# Altium project bolid.PrjPcb (part 3 of 6)

## Sheet bolid-power-dcdc-ldo.SchDoc
size A3
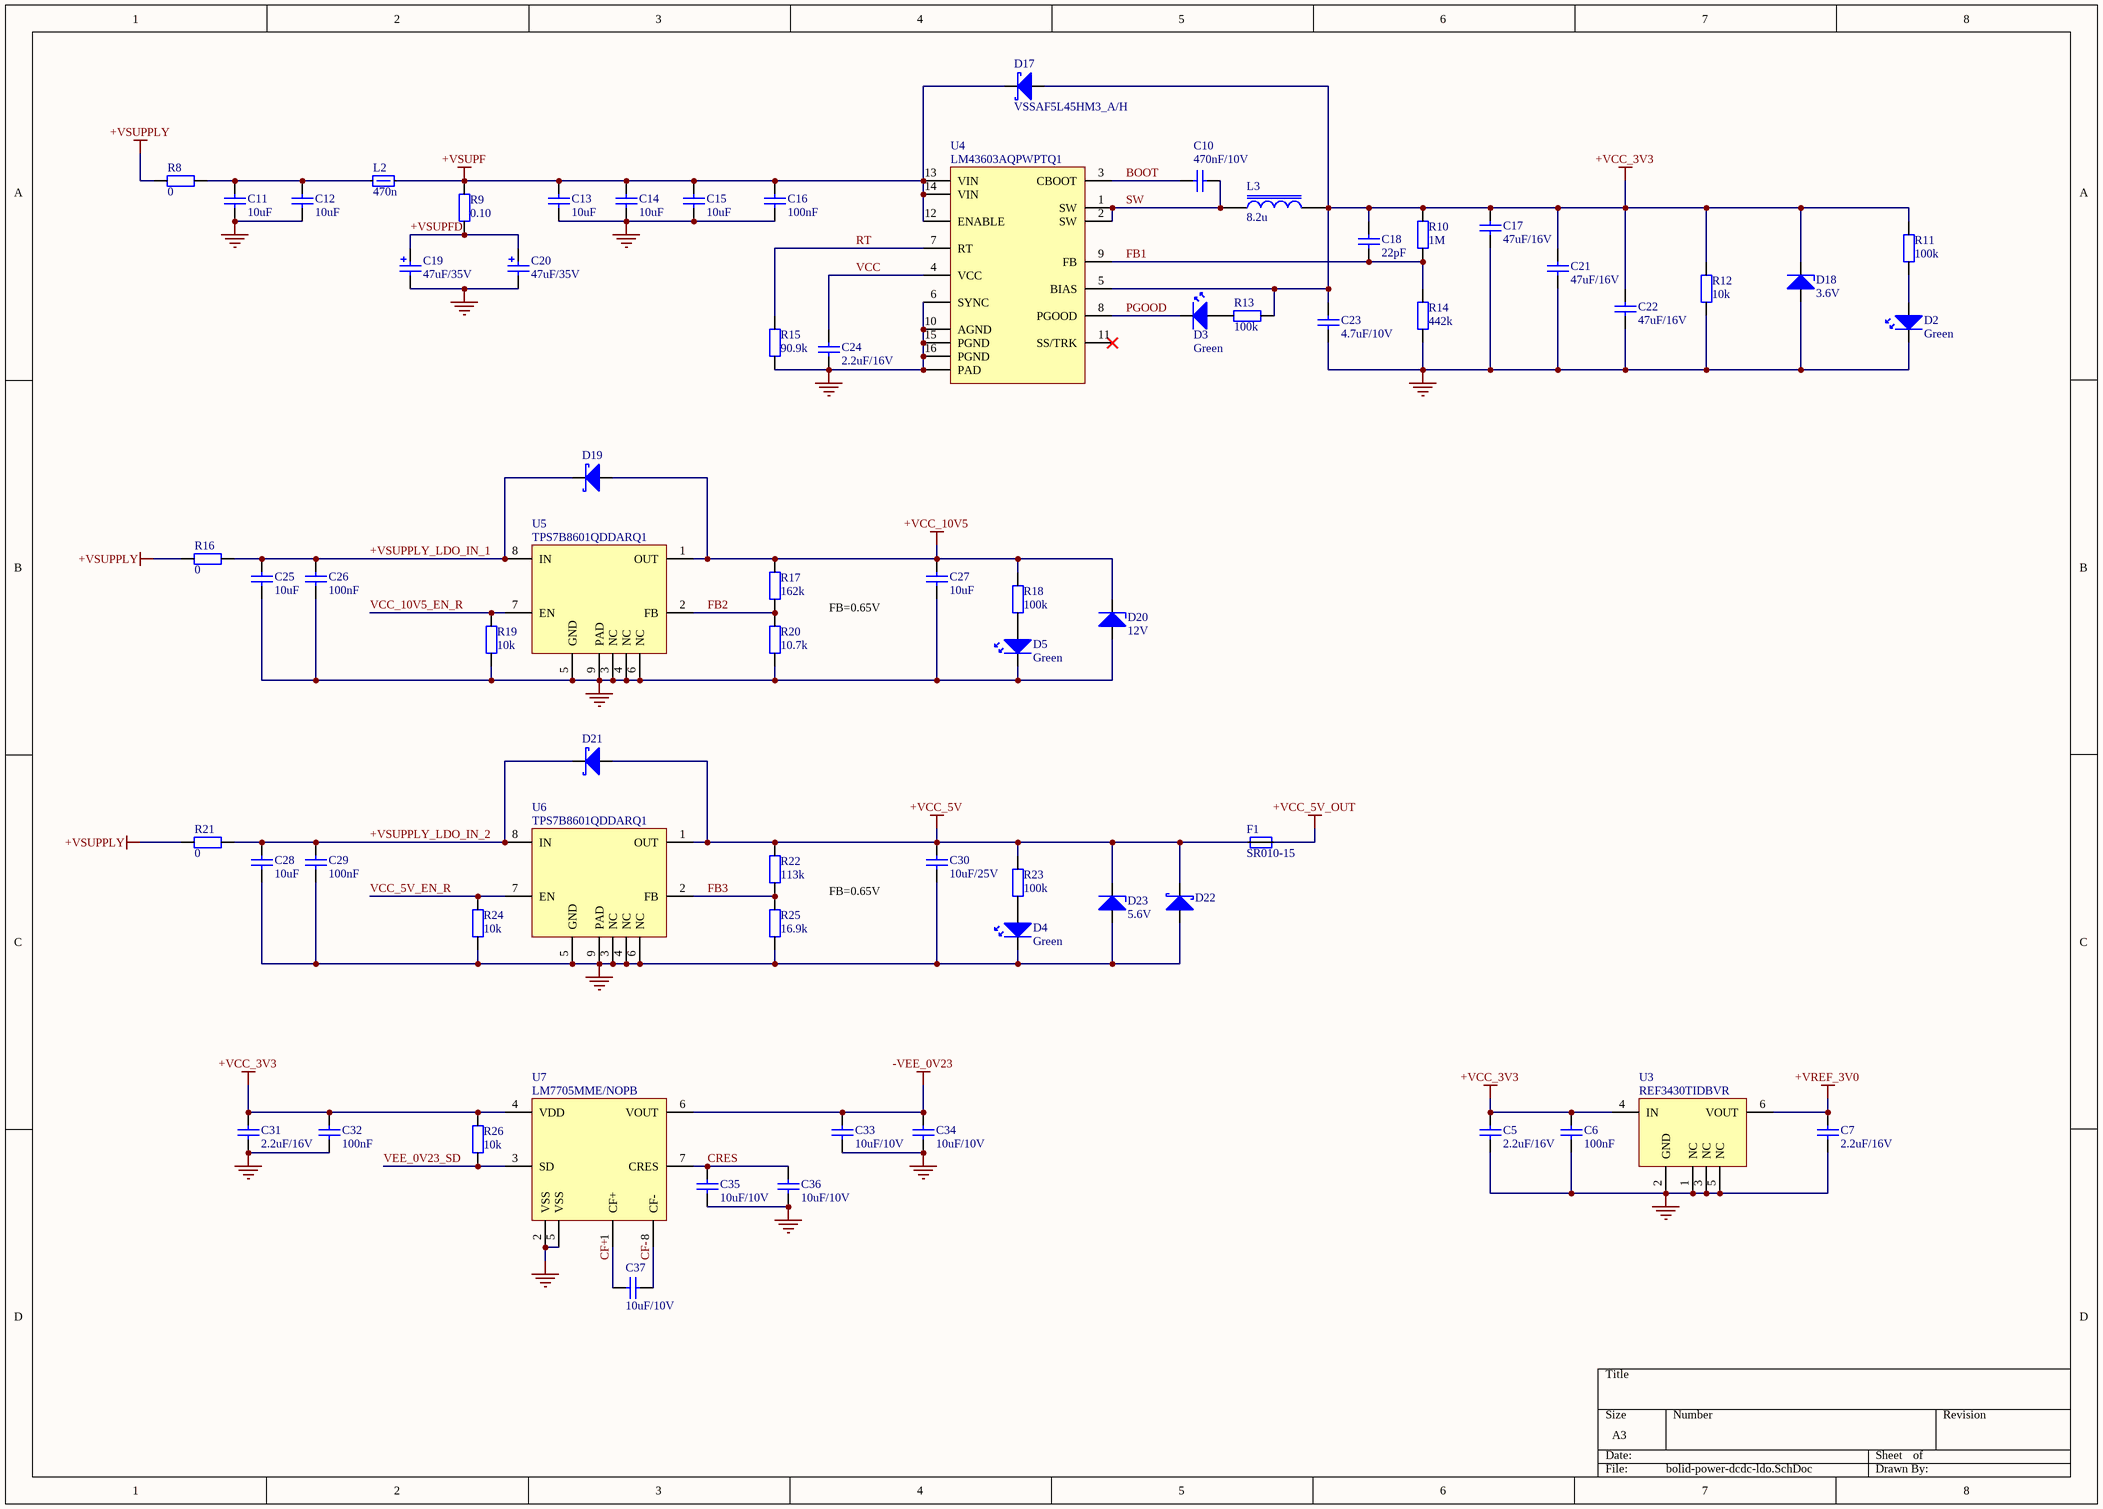
[diagram p5: bolid-power-dcdc-ldo.SchDoc]

### Parts
C5  Value Displayed: 2.2uF/16V  [C0603-CAPC162X80X95L35N]  (hidden comment: EMK107BB7225MA-T)
C6  Value Displayed: 100nF  [C0402-CAPC100X50X55L22 - Tayio Yuden TDK]  (hidden comment: GRM155R71H104KE14D)
C7  Value Displayed: 2.2uF/16V  [C0603-CAPC162X80X95L35N]  (hidden comment: EMK107BB7225MA-T)
C10  Value Displayed: 470nF/10V  [C0402-CAPC100X50X55L22 - Tayio Yuden TDK]  (hidden comment: GRM155R71A474KE01D)
C11  Value Displayed: 10uF  [C1210-CAPC320X250X280L55N - Kemet]  (hidden comment: C1210C106K5RACTU)
C12  Value Displayed: 10uF  [C1210-CAPC320X250X280L55N - Kemet]  (hidden comment: C1210C106K5RACTU)
C13  Value Displayed: 10uF  [C1210-CAPC320X250X280L55N - Kemet]  (hidden comment: C1210C106K5RACTU)
C14  Value Displayed: 10uF  [C1210-CAPC320X250X280L55N - Kemet]  (hidden comment: C1210C106K5RACTU)
C15  Value Displayed: 10uF  [C1210-CAPC320X250X280L55N - Kemet]  (hidden comment: C1210C106K5RACTU)
C16  Value Displayed: 100nF  [C0402-CAPC100X50X55L22 - Tayio Yuden TDK]  (hidden comment: GRM155R71H104KE14D)
C17  Value Displayed: 47uF/16V  [C1210-CAPC320X250X280L55N - Kemet]  (hidden comment: EMK325BJ476MM-P)
C18  Value Displayed: 22pF  [C0402-CAPC100X50X55L22 - Tayio Yuden TDK]  (hidden comment: GCM1555C1H220JA16D)
C19  Value Displayed: 47uF/35V  [C7374-43-CAPPM730X430X430L130X240N - Kemet Case X]  (hidden comment: T495X476K035ATE300)
C20  Value Displayed: 47uF/35V  [C7374-43-CAPPM730X430X430L130X240N - Kemet Case X]  (hidden comment: T495X476K035ATE300)
C21  Value Displayed: 47uF/16V  [C1210-CAPC320X250X280L55N - Kemet]  (hidden comment: EMK325BJ476MM-P)
C22  Value Displayed: 47uF/16V  [C1210-CAPC320X250X280L55N - Kemet]  (hidden comment: EMK325BJ476MM-P)
C23  Value Displayed: 4.7uF/10V  [C0402-CAPC100X50X55L22 - Tayio Yuden TDK]  (hidden comment: C1005X5R1A475M050BC)
C24  Value Displayed: 2.2uF/16V  [C0603-CAPC162X80X95L35N]  (hidden comment: EMK107BB7225MA-T)
C25  Value Displayed: 10uF  [C1210-CAPC320X250X280L55N - Kemet]  (hidden comment: C1210C106K5RACTU)
C26  Value Displayed: 100nF  [C0402-CAPC100X50X55L22 - Tayio Yuden TDK]  (hidden comment: GRM155R71H104KE14D)
C27  Value Displayed: 10uF  [C1210-CAPC320X250X280L55N - Kemet]  (hidden comment: C1210C106K5RACTU)
C28  Value Displayed: 10uF  [C1210-CAPC320X250X280L55N - Kemet]  (hidden comment: C1210C106K5RACTU)
C29  Value Displayed: 100nF  [C0402-CAPC100X50X55L22 - Tayio Yuden TDK]  (hidden comment: GRM155R71H104KE14D)
C30  Value Displayed: 10uF/25V  [C1206-CAPC320X160X190L65N - Murata]  (hidden comment: TMK316AB7106KL-T)
C31  Value Displayed: 2.2uF/16V  [C0603-CAPC162X80X95L35N]  (hidden comment: EMK107BB7225MA-T)
C32  Value Displayed: 100nF  [C0402-CAPC100X50X55L22 - Tayio Yuden TDK]  (hidden comment: GRM155R71H104KE14D)
C33  Value Displayed: 10uF/10V  [C0805-CAPC200X125X135L50N - Taiyo YudenN]  (hidden comment: GRM21BR71A106KA73K)
C34  Value Displayed: 10uF/10V  [C0805-CAPC200X125X135L50N - Taiyo YudenN]  (hidden comment: GRM21BR71A106KA73K)
C35  Value Displayed: 10uF/10V  [C0805-CAPC200X125X135L50N - Taiyo YudenN]  (hidden comment: GRM21BR71A106KA73K)
C36  Value Displayed: 10uF/10V  [C0805-CAPC200X125X135L50N - Taiyo YudenN]  (hidden comment: GRM21BR71A106KA73K)
C37  Value Displayed: 10uF/10V  [C0805-CAPC200X125X135L50N - Taiyo YudenN]  (hidden comment: GRM21BR71A106KA73K)
D2  Illumination Color: Green  [D0603 DIONC166X84X36L42N Littelfuse]  (hidden comment: 150060GS75000)
D3  Illumination Color: Green  [D0603 DIONC166X84X36L42N Littelfuse]  (hidden comment: 150060GS75000)
D4  Illumination Color: Green  [D0603 DIONC166X84X36L42N Littelfuse]  (hidden comment: 150060GS75000)
D5  Illumination Color: Green  [D0603 DIONC166X84X36L42N Littelfuse]  (hidden comment: 150060GS75000)
D17  VSSAF5L45HM3_A/H  [DO-221AC SlimSMA SODFL520X260X100L97X135N - Vishay]
D18  Zener Voltage: 3.6V  [SOT23 (TO-236AB) 04-11-04 SOT95P230X110-3N - Nexperia]  (hidden comment: BZX84-B3V6,215)
D19  MBR0530T3G  [SOD-123-2L SOD375X160X128L32X60N - Fairchild]  (value not drawn)
D20  Zener Voltage: 12V  [SOT23 (TO-236AB) 04-11-04 SOT95P230X110-3N - Nexperia]  (hidden comment: BZX84-C12,215)
D21  MBR0530T3G  [SOD-123-2L SOD375X160X128L32X60N - Fairchild]  (value not drawn)
D22  MBR0530T3G  [SOD-123-2L SOD375X160X128L32X60N - Fairchild]  (value not drawn)
D23  Zener Voltage: 5.6V  [SOT23 (TO-236AB) 04-11-04 SOT95P230X110-3N - Nexperia]  (hidden comment: BZX84-B5V6,215)
F1  SR010-15  [RESC2214X10N - SR010-15]
L2  value 470n  [MURATA DFE252012F 1008 INDC250X200X120L60N]  (hidden comment: DFE252012F-R47M=P2)
L3  value 8.2u  [Coilcraft XAL50xx]  (hidden comment: XAL5050-822MEB)
R8  value 0  [R0603-RESC160X80X55L30N]  (hidden comment: RC0603FR-070RL)
R9  value 0.10  [R0603-RESC160X80X55L30N]  (hidden comment: ERJ-3RSFR10V)
R10  value 1M  [R0402-RESC100X50X40L22N]  (hidden comment: AC0402FR-071ML)
R11  value 100k  [R0402-RESC100X50X40L22N]  (hidden comment: RC0402FR-07100KL)
R12  value 10k  [R0402-RESC100X50X40L22N]  (hidden comment: RC0402FR-0710KL)
R13  value 100k  [R0402-RESC100X50X40L22N]  (hidden comment: RC0402FR-07100KL)
R14  value 442k  [R0402-RESC100X50X40L22N]  (hidden comment: ERJ-2RKF4423X)
R15  value 90.9k  [R0402-RESC100X50X40L22N]  (hidden comment: RC0402FR-0790K9L)
R16  value 0  [R0603-RESC160X80X55L30N]  (hidden comment: RC0603FR-070RL)
R17  value 162k  [R0402-RESC100X50X40L22N]  (hidden comment: AC0402FR-07162KL)
R18  value 100k  [R0402-RESC100X50X40L22N]  (hidden comment: RC0402FR-07100KL)
R19  value 10k  [R0402-RESC100X50X40L22N]  (hidden comment: RC0402FR-0710KL)
R20  value 10.7k  [R0402-RESC100X50X40L22N]  (hidden comment: AC0402FR-0710K7L)
R21  value 0  [R0603-RESC160X80X55L30N]  (hidden comment: RC0603FR-070RL)
R22  value 113k  [R0402-RESC100X50X40L22N]  (hidden comment: RC0402FR-07113KL)
R23  value 100k  [R0402-RESC100X50X40L22N]  (hidden comment: RC0402FR-07100KL)
R24  value 10k  [R0402-RESC100X50X40L22N]  (hidden comment: RC0402FR-0710KL)
R25  value 16.9k  [R0402-RESC100X50X40L22N]  (hidden comment: RC0402FR-0716K9L)
R26  value 10k  [R0402-RESC100X50X40L22N]  (hidden comment: RC0402FR-0710KL)
U3  REF3430TIDBVR  [TI SOT23 DBV0006A SOT23-6P95_280X145L45X37N]
U4  LM43603AQPWPTQ1  [TI TSSOP16 PWP0016G SOP17P65_500X640X120L62X24T300X210N - NO PASTE REDUCTION]
U5  TPS7B8601QDDARQ1  [TI SOIC8 DDA0008E-C01 SOIC127P600X170_HS-9N]
U6  TPS7B8601QDDARQ1  [TI SOIC8 DDA0008E-C01 SOIC127P600X170_HS-9N]
U7  LM7705MME/NOPB  [TI VSSOP8 DGK0008A TSOP65P490X110-8N]

### Nets
+VCC_3V3: C5.2 C6.2 C17.2 C18.2 C21.2 C22.2 C23.2 C31.2 C32.2 D17.2(A) D18.3(K) L3.2 R10.2 R11.2 R12.2 R13.2 R26.2 U3.4(IN) U4.5(BIAS) U7.4(VDD)
+VCC_5V: C30.2 D21.2(A) D22.1(K) D23.3(K) F1.1 R22.2 R23.2 U6.1(OUT)
+VCC_5V_OUT: F1.2
+VCC_10V5: C27.2 D19.2(A) D20.3(K) R17.2 R18.2 U5.1(OUT)
+VREF_3V0: C7.2 U3.6(VOUT)
+VSUPF: C13.2 C14.2 C15.2 C16.2 D17.1(K) L2.2 R9.2 U4.12(ENABLE) U4.13(VIN) U4.14(VIN)
+VSUPPLY: R8.1 R16.1 R21.1
-VEE_0V23: C33.2 C34.2 U7.6(VOUT)
GND: C5.1 C6.1 C7.1 C11.1 C12.1 C13.1 C14.1 C15.1 C16.1 C17.1 C19.1 C20.1 C21.1 C22.1 C23.1 C24.1 C25.1 C26.1 C27.1 C28.1 C29.1 C30.1 C31.1 C32.1 C33.1 C34.1 C35.1 C36.1 D2.1(K) D4.1(K) D5.1(K) D18.1(A) D20.1(A) D22.2(A) D23.1(A) R12.1 R14.1 R15.1 R19.1 R20.1 R24.1 R25.1 U3.1(NC) U3.2(GND) U3.3(NC) U3.5(NC) U4.6(SYNC) U4.10(AGND) U4.15(PGND) U4.16(PGND) U4.17(PAD) U5.3(NC) U5.4(NC) U5.5(GND) U5.6(NC) U5.9(PAD) U6.3(NC) U6.4(NC) U6.5(GND) U6.6(NC) U6.9(PAD) U7.2(VSS) U7.5(VSS)
+VSUPFD: C19.2 C20.2 R9.1
+VSUPPLY_LDO_IN_1: C25.2 C26.2 D19.1(K) R16.2 U5.8(IN)
+VSUPPLY_LDO_IN_2: C28.2 C29.2 D21.1(K) R21.2 U6.8(IN)
BOOT: C10.1 U4.3(CBOOT)
CF+: C37.2 U7.1(CF+)
CF-: C37.1 U7.8(CF-)
CRES: C35.2 C36.2 U7.7(CRES)
FB1: C18.1 R10.1 R14.2 U4.9(FB)
FB2: R17.1 R20.2 U5.2(FB)
FB3: R22.1 R25.2 U6.2(FB)
PGOOD: D3.1(K) U4.8(PGOOD)
RT: R15.2 U4.7(RT)
SW: C10.2 L3.1 U4.1(SW) U4.2(SW)
VCC: C24.2 U4.4(VCC)
VCC_5V_EN_R: R24.2 U6.7(EN)
VCC_10V5_EN_R: R19.2 U5.7(EN)
VEE_0V23_SD: R26.1 U7.3(SD)
NetC11_2: C11.2 C12.2 L2.1 R8.2
NetD2_2: D2.2(A) R11.1
NetD3_2: D3.2(A) R13.1
NetD4_2: D4.2(A) R23.1
NetD5_2: D5.2(A) R18.1

Not connected (* = marked no-connect by the designer): U4 11(SS/TRK)*

### Notes on the sheet
- (near C27) FB=0.65V
- (near C30) FB=0.65V

### Library data of the parts
C5 C7 C24 C31 = EMK107BB7225MA-T: MLCC 0603 (1608) 2.2uF 20% 16V X7R; Manufacturer: Taiyo Yuden; Type: AECStandardQ200; Voltage Rating DC: 16 VDC; Capacitance - nF: 2200 nF; Value: 2.2u; Supplier 1: Mouser; Manufacturer Part Number: EMK107BB7225MA-T; RoHS: RoHS Compliant; Category: Multilayer Ceramic Capacitors MLCC - SMD/SMT; Stock 1: 5687; Pricing 1: 1=0.324, 10=0.228, 100=0.129, 500=0.090, 1000=0.078, 4000=0.060, 8000=0.057, 12000=0.055, 24000=0.048 (EUR); Capacitance: 2.2 uF; Height: 0.8 mm; Length: 1.6 mm; Package / Case: 0603 (1608 metric); Packaging: Cut Tape; Product: Automotive MLCCs; Series: M; Termination Style: SMD/SMT; Tolerance: 20 %; Width: 0.8 mm; Brand: Taiyo Yuden; Case Code - in: 0603; Case Code - mm: 1608; Dielectric: X7R; Maximum Operating Temperature: + 125 C; Minimum Operating Temperature: - 55 C; Product Type: Ceramic Capacitors; Standard Pack Qty: 4000; Subcategory: Capacitors; Termination: Standard; RoHS - Mouser: Y; Minimum Order Quantity: 1; Reeling: True; ComponentLink1URL: https://www.mouser.com/datasheet/2/396/mlcc02_e-1307760.pdf; ComponentLink1Description: https://www.mouser.com/datasheet/2/396/mlcc02_e-1307760.pdf; Supplier Part Number 1: 963-EMK107BB7225MA-T
C6 C16 C26 C29 C32 = GRM155R71H104KE14D: MLCC 0402 (1005) 100nF 10% 50V X7R; Manufacturer: Murata Electronics; Capacitance: 0.1 uF; Type: Chip Multilayer Ceramic Capacitor for General Purpose; Voltage Rating DC: 50 VDC; Capacitance - pF: 100000 pF; Class: Class 2; Supplier 1: Mouser; Manufacturer Part Number: GRM155R71H104KE14D; RoHS: RoHS Compliant; Category: Multilayer Ceramic Capacitors MLCC - SMD/SMT; Stock 1: 3511637; Pricing 1: 1=0.090, 10=0.038, 100=0.016, 500=0.012, 1000=0.009, 2500=0.008, 5000=0.007, 10000=0.005 (EUR); Height: 0.5 mm; Length: 1 mm; Package / Case: 0402 (1005 metric); Packaging: Cut Tape; Product: General Type MLCCs; Series: GRM; Termination Style: SMD/SMT; Tolerance: 10 %; Width: 0.5 mm; Brand: Murata Electronics; Capacitance - nF: 100 nF; Case Code - in: 0402; Case Code - mm: 1005; Dielectric: X7R; Maximum Operating Temperature: + 125 C; Minimum Operating Temperature: - 55 C; Product Type: Ceramic Capacitors; Standard Pack Qty: 10000; Subcategory: Capacitors; Termination: Standard; RoHS - Mouser: Y; Minimum Order Quantity: 1; Reeling: True; ComponentLink1URL: https://www.mouser.com/datasheet/2/281/murata_03052018_GRM_Series_1-1310166.pdf; ComponentLink1Description: https://www.mouser.com/datasheet/2/281/murata_03052018_GRM_Series_1-1310166.pdf; Value: 100nF; Supplier Part Number 1: 81-GRM155R71H104KE4D
C10 = GRM155R71A474KE01D: MLCC 0402 (1005) 470nF 10% 10V X7R; Manufacturer: Murata Electronics; Capacitance: 0.47 uF; Type: Chip Multilayer Ceramic Capacitor for General Purpose; Voltage Rating DC: 10 VDC; Capacitance - pF: 470000 pF; Class: Class 2; Value: 470n; Supplier 1: Mouser; Manufacturer Part Number: GRM155R71A474KE01D; RoHS: RoHS Compliant; Category: Multilayer Ceramic Capacitors MLCC - SMD/SMT; Stock 1: 1591702; Pricing 1: 1=0.090, 10=0.064, 100=0.028, 500=0.020, 1000=0.015, 2500=0.014, 5000=0.013, 10000=0.010, 20000=0.009 (EUR); Height: 0.5 mm; Length: 1 mm; Package / Case: 0402 (1005 metric); Packaging: Cut Tape; Product: General Type MLCCs; Series: GRM; Termination Style: SMD/SMT; Tolerance: 10 %; Width: 0.5 mm; Brand: Murata Electronics; Capacitance - nF: 470 nF; Case Code - in: 0402; Case Code - mm: 1005; Dielectric: X7R; Maximum Operating Temperature: + 125 C; Minimum Operating Temperature: - 55 C; Product Type: Ceramic Capacitors; Standard Pack Qty: 10000; Subcategory: Capacitors; Termination: Standard; RoHS - Mouser: Y; Minimum Order Quantity: 1; Reeling: True; ComponentLink1URL: https://www.mouser.com/datasheet/2/281/murata_03052018_GRM_Series_1-1310166.pdf; ComponentLink1Description: https://www.mouser.com/datasheet/2/281/murata_03052018_GRM_Series_1-1310166.pdf; Supplier Part Number 1: 81-GRM155R71A474KE1D
C11-C15 C25 C27 C28 = C1210C106K5RACTU: MLCC 1210 (3225) 10uF 10% 50V X7R; Manufacturer: KEMET; Voltage Rating DC: 50 VDC; Class: Class 2; Supplier 1: Mouser; Manufacturer Part Number: C1210C106K5RACTU; RoHS: RoHS Compliant; Category: Multilayer Ceramic Capacitors MLCC - SMD/SMT; Stock 1: 1149; Pricing 1: 1=0.984, 10=0.728, 100=0.498, 500=0.394, 1000=0.296 (USD); Capacitance: 10 uF; Height: 2.5 mm; Length: 3.2 mm; Package / Case: 1210 (3225 metric); Packaging: Cut Tape; Product: General Type MLCCs; Series: SMD Comm X7R; Termination Style: SMD/SMT; Tolerance: 10 %; Voltage Rating AC: -; Width: 2.5 mm; Brand: KEMET; Case Code - in: 1210; Case Code - mm: 3225; Dielectric: X7R; Maximum Operating Temperature: + 125 C; Minimum Operating Temperature: - 55 C; Product Type: Ceramic Capacitors; Standard Pack Qty: 1000; Subcategory: Capacitors; Termination: Standard; RoHS - Mouser: Y; Minimum Order Quantity: 1; Reeling: True; ComponentLink1URL: https://www.mouser.com/datasheet/2/212/KEM_C1002_X7R_SMD-1102033.pdf; ComponentLink1Description: https://www.mouser.com/datasheet/2/212/KEM_C1002_X7R_SMD-1102033.pdf; Supplier Part Number 1: 80-C1210C106K5R; Value: 10uF
C17 C21 C22 = EMK325BJ476MM-P: MLCC 1210 (3225) 47.0uF 20% 16V X5R; Manufacturer: Taiyo Yuden; Capacitance: 47 uF; Type: Multilayer Ceramic Capacitors; Voltage Rating DC: 16 VDC; Value: 47u; Supplier 1: Mouser; Manufacturer Part Number: EMK325BJ476MM-P; RoHS: RoHS Compliant; Category: Multilayer Ceramic Capacitors MLCC - SMD/SMT; Stock 1: 61399; Pricing 1: 1=0.639, 10=0.396, 100=0.266, 500=0.224, 1000=0.180, 2000=0.167, 5000=0.156, 10000=0.135, 25000=0.131 (EUR); Height: 2.5 mm; Length: 3.2 mm; Package / Case: 1210 (3225 metric); Packaging: Cut Tape; Product: General Type MLCCs; Series: M; Termination Style: SMD/SMT; Tolerance: 20 %; Width: 2.5 mm; Brand: Taiyo Yuden; Case Code - in: 1210; Case Code - mm: 3225; Dielectric: X5R; Maximum Operating Temperature: + 85 C; Minimum Operating Temperature: - 55 C; Product Type: Ceramic Capacitors; Standard Pack Qty: 1000; Subcategory: Capacitors; Termination: Standard; RoHS - Mouser: Y; Minimum Order Quantity: 1; Reeling: True; ComponentLink1URL: https://www.mouser.com/datasheet/2/396/mlcc02_e-1307760.pdf; ComponentLink1Description: https://www.mouser.com/datasheet/2/396/mlcc02_e-1307760.pdf; Supplier Part Number 1: 963-EMK325BJ476MM-P
C18 = GCM1555C1H220JA16D: MLCC 0402 (1005) 22pF 5% 50V C0G (NP0); Manufacturer: Murata Electronics; Type: Chip Multilayer Ceramic Capacitors for Automotive; Voltage Rating DC: 50 VDC; Class: Class 1; Qualification: AEC-Q200; Value: 22p; Supplier 1: Mouser; Manufacturer Part Number: GCM1555C1H220JA16D; RoHS: RoHS Compliant; Category: Multilayer Ceramic Capacitors MLCC - SMD/SMT; Stock 1: 193169; Pricing 1: 1=0.085, 10=0.026, 100=0.022, 500=0.015, 1000=0.013, 2500=0.011, 5000=0.010, 10000=0.008 (EUR); Capacitance: 22 pF; Height: 0.5 mm; Length: 1 mm; Package / Case: 0402 (1005 metric); Packaging: Cut Tape; Product: Automotive MLCCs; Series: GCM; Termination Style: SMD/SMT; Tolerance: 5 %; Voltage Rating AC: -; Width: 0.5 mm; Brand: Murata Electronics; Case Code - in: 0402; Case Code - mm: 1005; Dielectric: C0G (NP0); Maximum Operating Temperature: + 125 C; Minimum Operating Temperature: - 55 C; Product Type: Ceramic Capacitors; Standard Pack Qty: 10000; Subcategory: Capacitors; Termination: Standard; RoHS - Mouser: Y; Minimum Order Quantity: 1; Reeling: True; ComponentLink1URL: https://www.mouser.com/datasheet/2/281/GCM1555C1H220JA16_01-1964700.pdf; ComponentLink1Description: https://www.mouser.com/datasheet/2/281/GCM1555C1H220JA16_01-1964700.pdf; Supplier Part Number 1: 81-GCM1555C1H220JA6D
C19 C20 = T495X476K035ATE300: TANT 2917 (7343) 47uF 10% 35V Tantalum Kemet Case X; Mfr Case Code: X Case; Type: SMD Automotive Grade Surge Robust Low ESR; Voltage Rating DC: 35 VDC; ESR: 300 mOhms; Supplier 1: Mouser; Manufacturer: KEMET; Manufacturer Part Number: T495X476K035ATE300; RoHS: RoHS Compliant; Category: Tantalum Capacitors - Solid SMD; Stock 1: 39161; Pricing 1: 1=2.42, 10=1.94, 100=1.46, 500=0.989, 1000=0.897, 2500=0.884 (USD); Capacitance: 47 uF; Height: 4 mm; Length: 7.3 mm; Packaging: Cut Tape; Product: Tantalum Solid Low ESR Automotive Grade; Series: T495; Termination Style: SMD/SMT; Tolerance: 10 %; Width: 4.3 mm; Brand: KEMET; Case Code - in: 2917; Case Code - mm: 7343; Maximum Operating Temperature: + 125 C; Minimum Operating Temperature: - 55 C; Product Type: Tantalum Capacitors; Standard Pack Qty: 500; Subcategory: Capacitors; RoHS - Mouser: Y; Minimum Order Quantity: 1; Reeling: True; ComponentLink1URL: https://www.mouser.com/datasheet/2/212/KEM_T2009_T495-1092841.pdf; ComponentLink1Description: https://www.mouser.com/datasheet/2/212/KEM_T2009_T495-1092841.pdf; Value: 47uF; Supplier Part Number 1: 80-T495X476K35ATE300
C23 = C1005X5R1A475M050BC: MLCC 0402 (1005) 4.7uF 20% 10V X5R; Manufacturer: TDK; Type: Multilayer Ceramic Chip Capacitor; Voltage Rating DC: 10 VDC; Capacitance - nF: 4700 nF; Class: Class2; Value: 4.7u; Supplier 1: Mouser; Manufacturer Part Number: C1005X5R1A475M050BC; RoHS: RoHS Compliant; Category: Multilayer Ceramic Capacitors MLCC - SMD/SMT; Stock 1: 236282; Pricing 1: 1=0.398, 10=0.234, 100=0.170, 500=0.130, 1000=0.109, 2500=0.103, 5000=0.100, 10000=0.097 (EUR); Capacitance: 4.7 uF; Height: 0.5 mm; Length: 1 mm; Packaging: Cut Tape; Product: General Type MLCCs; Series: C; Termination Style: SMD/SMT; Tolerance: 20 %; Voltage Rating AC: -; Width: 0.5 mm; Brand: TDK; Case Code - in: 0402; Case Code - mm: 1005; Dielectric: X5R; Maximum Operating Temperature: + 85 C; Minimum Operating Temperature: - 55 C; Product Type: Ceramic Capacitors; Standard Pack Qty: 10000; Subcategory: Capacitors; Termination: Standard; RoHS - Mouser: Y; Minimum Order Quantity: 1; Reeling: True; Supplier Part Number 1: 810-C1005X5R1A475M
C30 = TMK316AB7106KL-T: MLCC 1206 (3216) 10uF 10% 25V X7R; Manufacturer: Taiyo Yuden; Type: General Purpose; Voltage Rating DC: 25 VDC; Class: Class 2; Value: 10u; Supplier 1: Mouser; Manufacturer Part Number: TMK316AB7106KL-T; RoHS: RoHS Compliant; Category: Multilayer Ceramic Capacitors MLCC - SMD/SMT; Stock 1: 162457; Pricing 1: 1=0.288, 10=0.130, 100=0.087, 500=0.077, 1000=0.068, 2000=0.056 (EUR); Capacitance: 10 uF; Diameter: -; Height: 1.6 mm; Length: 3.2 mm; Package / Case: 1206 (3216 metric); Packaging: Cut Tape; Product: General Type MLCCs; Series: M; Termination Style: SMD/SMT; Tolerance: 10 %; Width: 1.6 mm; Brand: Taiyo Yuden; Case Code - in: 1206; Case Code - mm: 3216; Dielectric: X7R; Maximum Operating Temperature: + 125 C; Minimum Operating Temperature: - 55 C; Product Type: Ceramic Capacitors; Standard Pack Qty: 2000; Subcategory: Capacitors; Termination: Standard; RoHS - Mouser: Y; Minimum Order Quantity: 1; Reeling: True; ComponentLink1URL: https://www.mouser.com/datasheet/2/396/mlcc02_e-1307760.pdf; ComponentLink1Description: https://www.mouser.com/datasheet/2/396/mlcc02_e-1307760.pdf; Supplier Part Number 1: 963-TMK316AB7106KL-T
C33-C37 = GRM21BR71A106KA73K: MLCC 0805 (2012) 10uF 10% 10V X7R; Manufacturer: Murata Electronics; Type: Chip Multilayer Ceramic Capacitor for General Purpose; Voltage Rating DC: 10 VDC; Class: Class 2; Value: 10u; Supplier 1: Mouser; Manufacturer Part Number: GRM21BR71A106KA73K; RoHS: RoHS Compliant; Category: Multilayer Ceramic Capacitors MLCC - SMD/SMT; Stock 1: 108729; Pricing 1: 1=0.207, 10=0.144, 100=0.072, 500=0.050, 1000=0.043, 2500=0.040, 5000=0.036, 10000=0.030, 20000=0.028 (EUR); Capacitance: 10 uF; Height: 1.25 mm; Length: 2 mm; Package / Case: 0805 (2012 metric); Packaging: Cut Tape; Product: General Type MLCCs; Series: GRM; Termination Style: SMD/SMT; Tolerance: 10 %; Width: 1.25 mm; Brand: Murata Electronics; Case Code - in: 0805; Case Code - mm: 2012; Dielectric: X7R; Maximum Operating Temperature: + 125 C; Minimum Operating Temperature: - 55 C; Product Type: Ceramic Capacitors; Standard Pack Qty: 10000; Subcategory: Capacitors; Termination: Standard; RoHS - Mouser: Y; Minimum Order Quantity: 1; Reeling: True; ComponentLink1URL: https://www.mouser.com/datasheet/2/281/murata_03052018_GRM_Series_1-1310166.pdf; ComponentLink1Description: https://www.mouser.com/datasheet/2/281/murata_03052018_GRM_Series_1-1310166.pdf; Supplier Part Number 1: 81-GRM21BR71A106KA3K
D2-D5 = 150060GS75000: LED 0603 (1608) Green; Manufacturer: Wurth Elektronik; Lens Color/Style: Water Clear; Power Rating: 105 mW; Lens Shape: Rectangular; Luminous Intensity: 430 mcd; Peak Wavelength: 515 nm; Viewing Angle: 140 deg; If - Forward Current: 20 mA; Vf - Forward Voltage: 3.2 V; Vr - Reverse Voltage: 5 V; Wavelength/Color Temperature: 520 nm; Supplier 1: Mouser; Manufacturer Part Number: 150060GS75000; RoHS: RoHS Compliant; Category: Standard LEDs - SMD; Stock 1: 17312; Pricing 1: 1=0.130, 10=0.126, 50=0.115, 100=0.099, 500=0.085, 4000=0.085 (EUR); Height: 0.7 mm; Length: 1.6 mm; Package / Case: 0603 (1608 metric); Packaging: Cut Tape; Product: Green LEDs; Series: WL-SMCW; Width: 0.8 mm; Brand: Wurth Elektronik; Mounting Style: SMD/SMT; Lens Dimensions: 1.1 mm x 0.8 mm; Lens Transparency: Water Clear; Maximum Operating Temperature: + 85 C; Minimum Operating Temperature: - 40 C; Moisture Sensitive: Yes; Product Type: LED - Standard; Standard Pack Qty: 4000; Subcategory: LEDs; RoHS - Mouser: Y; Minimum Order Quantity: 1; Reeling: True; ComponentLink1URL: https://www.mouser.com/datasheet/2/445/150060GS75000-368921.pdf; ComponentLink1Description: https://www.mouser.com/datasheet/2/445/150060GS75000-368921.pdf; Supplier Part Number 1: 710-150060GS75000
D17 = VSSAF5L45HM3_A/H: Schottky Rectifier Diode, 5A, Do-221Ac-2 Rohs Compliant: Yes |Vishay VSSAF5L45HM3_A/H; Manufacturer: Vishay; Supplier 1: Mouser; Manufacturer Part Number: VSSAF5L45HM3_A/H; RoHS: No; Category: Rectifier Diodes; Stock 1: 4251; Pricing 1: 1=0,45, 10=0,303, 50=0,303, 100=0,205, 1000=0,142, 10000=0,115 (USD); RoHS Compliant: Yes; Supplier Part Number 1: 78-VSSAF5L45HM3_A/H
D18 = BZX84-B3V6,215: Zener Diode Single 3.6V 2% 90Ohm 250mW Automotive 3-Pin SOT-23 T/R; Manufacturer: NXP Semiconductors; Impedance: 90R; Max Reverse Leakage Current: 5uA; Test Current: 5mA; Continuous Drain Current (ID): -150mA; Drain to Source Voltage (Vdss): -50V; Threshold Voltage: -1.6V; ESD Protection: No; Supplier 1: Mouser; Manufacturer Part Number: BZX84-B3V6,215; RoHS: Yes; Category: Uncategorized; Mount: Surface Mount; Case/Package: TO-236-3; Number of Pins: 3; Contact Plating: Tin; Min Operating Temperature: -65°C; Max Operating Temperature: 150°C; Packaging: Cut Tape; Package Quantity: 1; Tolerance: 2%; Max Power Dissipation: 250mW; Power Dissipation: 250mW; Voltage Tolerance: 2%; Element Configuration: Single; Radiation Hardening: No; Reach SVHC Compliant: Yes; Lead Free: Lead Free; RoHS Compliant: Yes; ComponentLink1URL: https://datasheet.ciiva.com/10645/bzx84-series-10645035.pdf?src-supplier=Avnet; ComponentLink1Description: https://datasheet.ciiva.com/10645/bzx84-series-10645035.pdf?src-supplier=Avnet; ComponentLink2URL: https://datasheet.ciiva.com/890/bzx84-ser-890061.pdf?src-supplier=Digi-Key; ComponentLink2Description: https://datasheet.ciiva.com/890/bzx84-ser-890061.pdf?src-supplier=Digi-Key; ComponentLink3URL: https://datasheet.ciiva.com/890/bzx84-ser-890063.pdf?src-supplier=Digi-Key; ComponentLink3Description: https://datasheet.ciiva.com/890/bzx84-ser-890063.pdf?src-supplier=Digi-Key; ComponentLink4URL: https://datasheet.ciiva.com/890/bzx84-series-890064.pdf?src-supplier=Digi-Key; ComponentLink4Description: https://datasheet.ciiva.com/890/bzx84-series-890064.pdf?src-supplier=Digi-Key; ComponentLink5URL: https://datasheet.ciiva.com/8347/bzx84-series-8347141.pdf?src-supplier=Avnet; ComponentLink5Description: https://datasheet.ciiva.com/8347/bzx84-series-8347141.pdf?src-supplier=Avnet; ComponentLink6URL: https://datasheet.ciiva.com/17265/bzx84-series-17265675.pdf?; ComponentLink6Description: https://datasheet.ciiva.com/17265/bzx84-series-17265675.pdf?; Supplier Part Number 1: 771-BZX84-B3V6215
D19 D21 D22 = MBR0530T3G: ON Semi MBR0530T3G; SMT Schottky Diode; 30V 500mA; 2-Pin SOD-123; Manufacturer: ON Semiconductor; Supplier 1: Mouser; Manufacturer Part Number: MBR0530T3G; RoHS: Yes; Category: Schottky Diodes; Stock 1: 167531; Pricing 1: 1=0,19, 10=0,126, 50=0,126, 100=0,065, 1000=0,053, 10000=0,041 (USD); ComponentLink1URL: https://datasheet.ciiva.com/6381/mbr0530t1-d-6381904.pdf?src-supplier=Digikey; ComponentLink1Description: https://datasheet.ciiva.com/6381/mbr0530t1-d-6381904.pdf?src-supplier=Digikey; ComponentLink2URL: https://datasheet.ciiva.com/7962/85890-7962703.pdf?src-supplier=Element14; ComponentLink2Description: https://datasheet.ciiva.com/7962/85890-7962703.pdf?src-supplier=Element14; ComponentLink3URL: https://datasheet.ciiva.com/8294/mbr0530t1-d-8294572.pdf?src-supplier=Avnet; ComponentLink3Description: https://datasheet.ciiva.com/8294/mbr0530t1-d-8294572.pdf?src-supplier=Avnet; ComponentLink4URL: https://datasheet.ciiva.com/15144/getdatasheetpartid-86762-15144599.pdf?src-supplier=Verical; ComponentLink4Description: https://datasheet.ciiva.com/15144/getdatasheetpartid-86762-15144599.pdf?src-supplier=Verical; ComponentLink5URL: https://datasheet.ciiva.com/6381/mbr0530t1-d-6381902.pdf?src-supplier=Digikey; ComponentLink5Description: https://datasheet.ciiva.com/6381/mbr0530t1-d-6381902.pdf?src-supplier=Digikey; Supplier Part Number 1: 863-MBR0530T3G
D20 = BZX84-C12,215: Diodes - Zener - Single Diode SOT-23 (TO-236AB) 250mW 12V Surface Mount; Manufacturer: Nexperia; Max Reverse Leakage Current: 100nA; Forward Current: 10mA; Reverse Voltage: 8V; Supplier 1: Mouser; Manufacturer Part Number: BZX84-C12,215; RoHS: Yes; Category: Zener Diodes; Stock 1: 259413; Pricing 1: 1=0,1, 10=0,05, 50=0,05, 100=0,029, 1000=0,024, 10000=0,015 (USD); Number of Pins: 3NUMBER; Min Operating Temperature: -65°C; Max Operating Temperature: 150°C; Packaging: 13Packaging; Power Dissipation: 250mW; Height: 1.1mm; ComponentLink1URL: http://www.farnell.com/datasheets/2242065.pdf?src-supplier=Farnell; ComponentLink1Description: http://www.farnell.com/datasheets/2242065.pdf?src-supplier=Farnell; ComponentLink2URL: http://www.farnell.com/datasheets/1808429.pdf?src-supplier=Farnell; ComponentLink2Description: http://www.farnell.com/datasheets/1808429.pdf?src-supplier=Farnell; ComponentLink3URL: http://www.farnell.com/datasheets/1808429.pdf?src-supplier=Newark; ComponentLink3Description: http://www.farnell.com/datasheets/1808429.pdf?src-supplier=Newark; ComponentLink4URL: https://datasheet.octopart.com/BZX84-C12%2C215-Nexperia-datasheet-14490340.pdf?src-supplier=Element14; ComponentLink4Description: https://datasheet.octopart.com/BZX84-C12%2C215-Nexperia-datasheet-14490340.pdf?src-supplier=Element14; ComponentLink5URL: https://datasheet.octopart.com/BZX84-C12%2C215-Nexperia-datasheet-24570111.pdf?src-supplier=Newark; ComponentLink5Description: https://datasheet.octopart.com/BZX84-C12%2C215-Nexperia-datasheet-24570111.pdf?src-supplier=Newark; ComponentLink6URL: https://datasheet.octopart.com/BZX84-C12%2C215-Nexperia-datasheet-116120567.pdf?src-supplier=Future+Electronics; ComponentLink6Description: https://datasheet.octopart.com/BZX84-C12%2C215-Nexperia-datasheet-116120567.pdf?src-supplier=Future+Electronics; ComponentLink7URL: https://assets.nexperia.com/documents/data-sheet/BZX84_SER.pdf?src-supplier=Digikey; ComponentLink7Description: https://assets.nexperia.com/documents/data-sheet/BZX84_SER.pdf?src-supplier=Digikey; ComponentLink8URL: https://datasheet.octopart.com/BZX84-C12%2C215-Nexperia-datasheet-81885907.pdf?src-supplier=TME; ComponentLink8Description: https://datasheet.octopart.com/BZX84-C12%2C215-Nexperia-datasheet-81885907.pdf?src-supplier=TME; Supplier Part Number 1: 771-BZX84-C12-T/R
D23 = BZX84-B5V6,215: Zener Diode, 5.6V V(Z), 2%, 0.25W, Silicon, Unidirectional, TO-236AB; Manufacturer: Nexperia; Supplier 1: Mouser; Manufacturer Part Number: BZX84-B5V6,215; RoHS: Yes; Category: Zener Diodes; Stock 1: 80701; Pricing 1: 1=0,12, 10=0,079, 50=0,079, 100=0,041, 1000=0,036, 10000=0,018 (USD); Number of Pins: 3NUMBER; ComponentLink1URL: https://datasheet.octopart.com/BZX84-B5V6%2C215-Nexperia-datasheet-24570111.pdf?src-supplier=Newark; ComponentLink1Description: https://datasheet.octopart.com/BZX84-B5V6%2C215-Nexperia-datasheet-24570111.pdf?src-supplier=Newark; ComponentLink2URL: https://datasheet.octopart.com/BZX84-B5V6%2C215-NXP-Semiconductors-datasheet-14490340.pdf?src-supplier=Element14; ComponentLink2Description: https://datasheet.octopart.com/BZX84-B5V6%2C215-NXP-Semiconductors-datasheet-14490340.pdf?src-supplier=Element14; ComponentLink3URL: https://datasheet.octopart.com/BZX84-B5V6%2C215-Nexperia-datasheet-81885907.pdf?src-supplier=TME; ComponentLink3Description: https://datasheet.octopart.com/BZX84-B5V6%2C215-Nexperia-datasheet-81885907.pdf?src-supplier=TME; Supplier Part Number 1: 771-BZX84-B5V6-T/R
F1 = SR010-15: PTC Fuse Hold Current 0.10A, Trip Current 0.30A VMax 15V; Manufacturer: Excel Cell; Supplier 1: TME; Manufacturer Part Number: SR010-15; RoHS: No; Stock 1: 5574; Supplier Part Number 1: SR010-15
L2 = DFE252012F-R47M=P2: Inductor Power Chip Shielded Wirewound 0.47uH 20% 1MHz Metal 4.9A 0.023Ohm DCR 1008 T/R; Manufacturer: Murata; Series Resistance: 23mR; Supplier 1: Mouser; Manufacturer Part Number: DFE252012F-R47M=P2; RoHS: Yes; Category: Fixed Inductors; Stock 1: 91663; Pricing 1: 1=0,31, 10=0,181, 50=0,181, 100=0,158, 1000=0,143, 10000=0,104 (USD); Inductance Tolerance: 20%; RMS Current (Irms): 4.9A; Height: 1.2mm; ComponentLink1URL: http://www.murata.com/~/media/webrenewal/products/inductor/chip/tokoproducts/wirewoundmetalalloychiptype/m_dfe252012f.ashx?src-supplier=Digikey; ComponentLink1Description: http://www.murata.com/~/media/webrenewal/products/inductor/chip/tokoproducts/wirewoundmetalalloychiptype/m_dfe252012f.ashx?src-supplier=Digikey; ComponentLink2URL: https://www.murata.com/~/media/webrenewal/products/inductor/chip/tokoproducts/wirewoundmetalalloychiptype/m_dfe252012f.ashx?src-supplier=Digikey; ComponentLink2Description: https://www.murata.com/~/media/webrenewal/products/inductor/chip/tokoproducts/wirewoundmetalalloychiptype/m_dfe252012f.ashx?src-supplier=Digikey; ComponentLink3URL: https://datasheet.octopart.com/DFE252012F-R47M%3DP2-Murata-datasheet-141944277.pdf?src-supplier=Arrow.cn; ComponentLink3Description: https://datasheet.octopart.com/DFE252012F-R47M%3DP2-Murata-datasheet-141944277.pdf?src-supplier=Arrow.cn; Supplier Part Number 1: 81-DFE252012F-R47MP2
L3 = XAL5050-822MEB: Fixed Inductors 8.2uH 20% 6.1A 34.95mOhms AEC-Q200; Manufacturer: Coilcraft; Core Material: Composite; Self Resonant Frequency: 18 MHz; Shielding: Shielded; Test Frequency: 100 kHz; Supplier 1: Mouser; Manufacturer Part Number: XAL5050-822MEB; RoHS: RoHS Compliant; Category: Fixed Inductors; Stock 1: 693; Pricing 1: 1=2.49, 10=2.23, 50=2.13, 250=2.13, 500=1.40, 1000=1.29, 2000=1.20 (EUR); Application: Power; Height: 5.1 mm; Inductance: 8.2 uH; Length: 5.68 mm; Maximum DC Current: 6.1 A; Maximum DC Resistance: 34.95 mOhms; Packaging: Cut Tape; Product: Power Inductors; Series: XAL5050; Termination Style: SMD/SMT; Tolerance: 20 %; Width: 5.48 mm; Brand: Coilcraft; Mounting Style: PCB Mount; Maximum Operating Temperature: + 125 C; Minimum Operating Temperature: - 40 C; Product Type: Fixed Inductors; Qualification: AEC-Q200; Standard Pack Qty: 250; Subcategory: Inductors, Chokes & Coils; Termination: -; RoHS - Mouser: Y; Minimum Order Quantity: 1; Reeling: True; ComponentLink1URL: https://www.mouser.com/datasheet/2/597/xal50xx-270657.pdf; ComponentLink1Description: https://www.mouser.com/datasheet/2/597/xal50xx-270657.pdf; Supplier Part Number 1: 994-XAL5050-822MEB
R8 R16 R21 = RC0603FR-070RL: RES 0603 (1608) 0.00 ohm 1% 0.100W 75V Thick Film; Manufacturer: Yageo; Power Rating: 100 mW, 200 mW; Resistance: 0 Ohms; Supplier 1: Mouser; Manufacturer Part Number: RC0603FR-070RL; RoHS: RoHS Compliant By Exemption; Category: Thick Film Resistors - SMD; Stock 1: 1394667; Pricing 1: 1=0.098, 10=0.015, 100=0.005, 1000=0.003, 5000=0.003 (USD); Application: High Reliability; Features: Zero Ohm Jumpers; Height: 0.45 mm; Length: 1.6 mm; Package/Case: -; Packaging: Cut Tape; Product: Thick Film Resistors Zero-Ohm; Series: RC; Technology: Thick Film; Termination Style: SMD/SMT; Tolerance: 1 %; Voltage Rating: 75 V; Width: 0.8 mm; Brand: Yageo; Mounting Style: PCB Mount; Case Code - in: 0603; Case Code - mm: 1608; Maximum Operating Temperature: + 155 C; Minimum Operating Temperature: - 55 C; Product Type: Thick Film Resistors; Standard Pack Qty: 5000; Subcategory: Resistors; RoHS - Mouser: E; Minimum Order Quantity: 1; Reeling: True; ComponentLink1URL: https://www.mouser.com/datasheet/2/447/PYu-RC_Group_51_RoHS_L_10-1527934.pdf; ComponentLink1Description: https://www.mouser.com/datasheet/2/447/PYu-RC_Group_51_RoHS_L_10-1527934.pdf; Supplier Part Number 1: 603-RC0603FR-070RL
R9 = ERJ-3RSFR10V: RES 0603 (1608) 0.10 ohm 1% 0.100W Thick Film; Manufacturer: Panasonic; Power Rating: 100 mW (1/10 W); Resistance: 100 mOhms; Temperature Coefficient: 200 PPM / C; Qualification: AEC-Q200; Supplier 1: Mouser; Manufacturer Part Number: ERJ-3RSFR10V; RoHS: RoHS Compliant By Exemption; Category: Current Sense Resistors - SMD; Stock 1: 97836; Pricing 1: 1=0.279, 10=0.124, 100=0.055, 1000=0.038, 5000=0.029 (EUR); Application: Current Sense; Features: -; Height: 0.45 mm; Length: 1.6 mm; Packaging: Cut Tape; Product: Thick Film Resistors SMD; Series: ERJ-xRQ/S; Technology: Thick Film; Termination Style: SMD/SMT; Tolerance: 1 %; Type: Low Resistance; Width: 0.8 mm; Brand: Panasonic; Mounting Style: PCB Mount; Case Code - in: 0603; Case Code - mm: 1608; Maximum Operating Temperature: + 125 C; Minimum Operating Temperature: - 55 C; Product Type: Current Sense Resistors; Standard Pack Qty: 5000; Subcategory: Resistors; Termination: 2 Terminal; RoHS - Mouser: E; Minimum Order Quantity: 1; Reeling: True; ComponentLink1URL: https://www.mouser.com/datasheet/2/315/AOA0000C313-1141758.pdf; ComponentLink1Description: https://www.mouser.com/datasheet/2/315/AOA0000C313-1141758.pdf; Supplier Part Number 1: 667-ERJ-3RSFR10V
R10 = AC0402FR-071ML: RES 0402 (1005) 1.00M 1% 0.0625W 50V Thick Film; Manufacturer: YAGEO; Power Rating: 62.5 mW (1/16 W); Resistance: 1 MOhms; Temperature Coefficient: 100 PPM / C; Qualification: AEC-Q200; Supplier 1: Mouser; Manufacturer Part Number: AC0402FR-071ML; RoHS: RoHS Compliant By Exemption; Category: Thick Film Resistors - SMD; Stock 1: 142366; Pricing 1: 1=0.085, 10=0.019, 100=0.008, 1000=0.004, 2500=0.003, 10000=0.003 (EUR); Application: Automotive Grade; Height: 0.32 mm; Length: 1 mm; Packaging: Cut Tape; Product: Thick Film Resistors General Purpose; Series: AC; Technology: Thick Film; Termination Style: SMD/SMT; Tolerance: 1 %; Type: General Purpose Resistor; Voltage Rating: 50 V; Width: 0.5 mm; Brand: YAGEO; Mounting Style: PCB Mount; Case Code - in: 0402; Case Code - mm: 1005; Maximum Operating Temperature: + 155 C; Minimum Operating Temperature: - 55 C; Product Type: Thick Film Resistors; Standard Pack Qty: 10000; Subcategory: Resistors; RoHS - Mouser: E; Minimum Order Quantity: 1; Reeling: True; ComponentLink1URL: https://www.mouser.com/datasheet/2/447/Yageo_PYu_AC_51_RoHS_L_7_1714230-1874691.pdf; ComponentLink1Description: https://www.mouser.com/datasheet/2/447/Yageo_PYu_AC_51_RoHS_L_7_1714230-1874691.pdf; Supplier Part Number 1: 603-AC0402FR-071ML
R11 R13 R18 R23 = RC0402FR-07100KL: RES 0402 (1005) 100.0k 1% 0.0625W 50V Thick Film; Manufacturer: Yageo; Power Rating: 62.5 mW, 125 mW; Resistance: 100 kOhms; Temperature Coefficient: 100 PPM / C; Supplier 1: Mouser; Manufacturer Part Number: RC0402FR-07100KL; RoHS: RoHS Compliant; Category: Thick Film Resistors - SMD; Stock 1: 2491111; Pricing 1: 1=0.090, 10=0.011, 100=0.004, 1000=0.003, 10000=0.003 (EUR); Application: High Reliability; Features: -; Height: 0.35 mm; Length: 1 mm; Package / Case: -; Packaging: Cut Tape; Product: Thick Film Resistors SMD; Series: RC; Technology: Thick Film; Termination Style: SMD/SMT; Tolerance: 1 %; Type: General Purpose; Voltage Rating: 50 V; Width: 0.5 mm; Brand: Yageo; Mounting Style: PCB Mount; Case Code - in: 0402; Case Code - mm: 1005; Maximum Operating Temperature: + 155 C; Minimum Operating Temperature: - 55 C; Product Type: Thick Film Resistors; Standard Pack Qty: 10000; Subcategory: Resistors; RoHS - Mouser: Y; Minimum Order Quantity: 1; Reeling: True; ComponentLink1URL: https://www.mouser.com/datasheet/2/447/PYu-RC_Group_51_RoHS_L_10-1664068.pdf; ComponentLink1Description: https://www.mouser.com/datasheet/2/447/PYu-RC_Group_51_RoHS_L_10-1664068.pdf; Supplier Part Number 1: 603-RC0402FR-07100KL
R12 R19 R24 R26 = RC0402FR-0710KL: RES 0402 (1005) 10.0k 1% 0.0625W 50V Thick Film; Manufacturer: Yageo; Power Rating: 62.5 mW, 125 mW; Resistance: 10 kOhms; Temperature Coefficient: 100 PPM / C; Supplier 1: Mouser; Manufacturer Part Number: RC0402FR-0710KL; RoHS: RoHS Compliant; Category: Thick Film Resistors - SMD; Stock 1: 20942447; Pricing 1: 1=0.090, 10=0.011, 100=0.004, 1000=0.003, 10000=0.003 (EUR); Application: High Reliability; Features: -; Height: 0.35 mm; Length: 1 mm; Package / Case: -; Packaging: Cut Tape; Product: Thick Film Resistors SMD; Series: RC; Technology: Thick Film; Termination Style: SMD/SMT; Tolerance: 1 %; Type: General Purpose; Voltage Rating: 50 V; Width: 0.5 mm; Brand: Yageo; Mounting Style: PCB Mount; Case Code - in: 0402; Case Code - mm: 1005; Maximum Operating Temperature: + 155 C; Minimum Operating Temperature: - 55 C; Product Type: Thick Film Resistors; Standard Pack Qty: 10000; Subcategory: Resistors; RoHS - Mouser: Y; Minimum Order Quantity: 1; Reeling: True; ComponentLink1URL: https://www.mouser.com/datasheet/2/447/PYu-RC_Group_51_RoHS_L_10-1664068.pdf; ComponentLink1Description: https://www.mouser.com/datasheet/2/447/PYu-RC_Group_51_RoHS_L_10-1664068.pdf; Supplier Part Number 1: 603-RC0402FR-0710KL
R14 = ERJ-2RKF4423X: RES 0402 (1005) 442.0k 1% 0.100W 50V Thick Film; Manufacturer: Panasonic; Power Rating: 100 mW (1/10 W); Resistance: 442 kOhms; Temperature Coefficient: 100 PPM / C; Qualification: AEC-Q200; Supplier 1: Mouser; Manufacturer Part Number: ERJ-2RKF4423X; RoHS: RoHS Compliant By Exemption; Category: Thick Film Resistors - SMD; Stock 1: 56067; Pricing 1: 1=0.085, 10=0.025, 100=0.010, 1000=0.005, 2500=0.004, 5000=0.003, 10000=0.003 (EUR); Application: Automotive Grade; Features: Precision Resistors; Height: 0.35 mm; Length: 1 mm; Packaging: Cut Tape; Product: Thick Film Resistors SMD; Series: ERJ-2Rx; Technology: Thick Film; Termination Style: SMD/SMT; Tolerance: 1 %; Voltage Rating: 50 V; Width: 0.5 mm; Brand: Panasonic; Mounting Style: PCB Mount; Case Code - in: 0402; Case Code - mm: 1005; Maximum Operating Temperature: + 155 C; Minimum Operating Temperature: - 55 C; Product Type: Thick Film Resistors; Standard Pack Qty: 10000; Subcategory: Resistors; RoHS - Mouser: E; Minimum Order Quantity: 1; Reeling: True; ComponentLink1URL: https://www.mouser.com/datasheet/2/315/AOA0000C304-1149620.pdf; ComponentLink1Description: https://www.mouser.com/datasheet/2/315/AOA0000C304-1149620.pdf; Supplier Part Number 1: 667-ERJ-2RKF4423X
R15 = RC0402FR-0790K9L: RES 0402 (1005) 90.9k 1% 0.0625W 50V Thick Film; Manufacturer: YAGEO; Power Rating: 62.5 mW (1/16 W); Resistance: 90.9 kOhms; Temperature Coefficient: 100 PPM / C; Supplier 1: Mouser; Manufacturer Part Number: RC0402FR-0790K9L; RoHS: RoHS Compliant By Exemption; Category: Thick Film Resistors - SMD; Stock 1: 41956; Pricing 1: 1=0.088, 10=0.014, 100=0.006, 1000=0.003, 10000=0.001 (EUR); Application: High Reliability; Features: -; Height: 0.35 mm; Length: 1 mm; Packaging: Cut Tape; Product: Thick Film Resistors SMD; Series: RC; Technology: Thick Film; Termination Style: SMD/SMT; Tolerance: 1 %; Type: General Purpose; Voltage Rating: 50 V; Width: 0.5 mm; Brand: YAGEO; Mounting Style: PCB Mount; Case Code - in: 0402; Case Code - mm: 1005; Maximum Operating Temperature: + 155 C; Minimum Operating Temperature: - 55 C; Product Type: Thick Film Resistors; Standard Pack Qty: 10000; Subcategory: Resistors; RoHS - Mouser: E; Minimum Order Quantity: 1; Reeling: True; ComponentLink1URL: https://www.mouser.com/datasheet/2/447/PYu_RC_Group_51_RoHS_L_10-1664068.pdf; ComponentLink1Description: https://www.mouser.com/datasheet/2/447/PYu_RC_Group_51_RoHS_L_10-1664068.pdf; Supplier Part Number 1: 603-RC0402FR-0790K9L
R17 = AC0402FR-07162KL: RES 0402 (1005) 162.0k 1% 0.125W 50V Thick Film; Manufacturer: Yageo; Resistance: 162kR; Max Power Dissipation: 63mW; Temperature Coefficient: 100ppm/°C; Supplier 1: Mouser; Manufacturer Part Number: AC0402FR-07162KL; RoHS: Yes; Category: Chip SMD Resistors; Stock 1: 32447; Pricing 1: 1=0,1, 10=0,012, 50=0,012, 100=0,007, 1000=0,005, 10000=0,003 (USD); Case/Package: 0402; Min Operating Temperature: -55°C; Max Operating Temperature: 155°C; Packaging: Tape and Reel; Number of Terminations: 2; Tolerance: 1%; Features: Moisture Resistant,Automotive AEC-Q200; Series: AC; Voltage Rating: 50V; Length: 0.039inch; Width: 0.02inch; Height: 0.015inch; RoHS Compliant: Yes; ComponentLink1URL: http://www.yageo.com/NewPortal/yageodocoutput?fileName=/pdf/R-Chip/PYu-AC_51_RoHS_L_6.pdf&src-supplier=Digikey; ComponentLink1Description: http://www.yageo.com/NewPortal/yageodocoutput?fileName=/pdf/R-Chip/PYu-AC_51_RoHS_L_6.pdf&src-supplier=Digikey; Supplier Part Number 1: 603-AC0402FR-07162KL
R20 = AC0402FR-0710K7L: RES 0402 (1005) 10.7k 1% 0.125W 50V Thick Film; Manufacturer: Yageo; Power Rating: 62.5mW; Resistance: 10.7kR; Temperature Coefficient: 100ppm/°C; Max Power Dissipation: 63mW; Supplier 1: Mouser; Manufacturer Part Number: AC0402FR-0710K7L; RoHS: Yes; Category: Chip SMD Resistors; Stock 1: 37509; Pricing 1: 1=0,1, 10=0,01, 50=0,01, 100=0,007, 1000=0,006, 10000=0,002 (USD); Case/Package: 0402; Case Code (Imperial): 0402; Case Code (Metric): 1005; Weight: 2.3E-05oz; Min Operating Temperature: -55°C; Max Operating Temperature: 155°C; Packaging: Tape and Reel; Tolerance: 1%; Voltage Rating: 50V; Termination: SMD/SMT; Number of Terminations: 2; Features: Moisture Resistant,Automotive AEC-Q200; Series: AC; Length: 0.039inch; Width: 0.5mm; Height: 0.015inch; RoHS Compliant: Yes; ComponentLink1URL: https://datasheet.ciiva.com/12576/pyu-ac-51-rohs-l-2-12576588.pdf?src-supplier=Mouser; ComponentLink1Description: https://datasheet.ciiva.com/12576/pyu-ac-51-rohs-l-2-12576588.pdf?src-supplier=Mouser; Supplier Part Number 1: 603-AC0402FR-0710K7L
R22 = RC0402FR-07113KL: RES 0402 (1005) 113.0k 1% 0.0625W 50V Thick Film; Manufacturer: Yageo; Supplier 1: Mouser; Manufacturer Part Number: RC0402FR-07113KL; RoHS: Yes; Category: Chip SMD Resistors; Stock 1: 42603; Pricing 1: 1=0,1, 10=0,007, 50=0,007, 100=0,004, 1000=0,003, 10000=0,002 (USD); Voltage Rating (DC): 50V; Lead Free: 5697LeadFree; ComponentLink1URL: https://datasheet.ciiva.com/16744/pyu-rc0402-51-rohs-l-6-r-16744521.pdf?src-supplier=Future+Electronics; ComponentLink1Description: https://datasheet.ciiva.com/16744/pyu-rc0402-51-rohs-l-6-r-16744521.pdf?src-supplier=Future+Electronics; ComponentLink2URL: https://datasheet.ciiva.com/2452/pyu-r-int-thick-7-2452604.pdf?src-supplier=Digikey; ComponentLink2Description: https://datasheet.ciiva.com/2452/pyu-r-int-thick-7-2452604.pdf?src-supplier=Digikey; Supplier Part Number 1: 603-RC0402FR-07113KL
R25 = RC0402FR-0716K9L: RES 0402 (1005) 16.9k 1% 0.0625W 50V Thick Film; Manufacturer: Yageo; Resistance: 16.9kR; Power Rating: 62.5mW; Max Power Dissipation: 63mW; Temperature Coefficient: 100ppm/°C; Supplier 1: Mouser; Manufacturer Part Number: RC0402FR-0716K9L; RoHS: Yes; Category: Chip SMD Resistors; Stock 1: 109384; Pricing 1: 1=0,1, 10=0,008, 50=0,008, 100=0,005, 1000=0,005, 10000=0,002 (USD); Case/Package: 0402; Case Code (Imperial): 0402; Case Code (Metric): 1005; Contact Plating: Tin,Matte; Size Code: 0402; Min Operating Temperature: -55°C; Max Operating Temperature: 155°C; Package Quantity: 10000; Tolerance: 1%; Voltage Rating: 50V; Packaging: Tape and Reel; Number of Terminations: 2; Termination: SMD/SMT; Voltage Rating (DC): 50V; Features: Moisture Resistant; Series: RC; Length: 0.039inch; Width: 0.5mm; Height: 0.016inch; Lead Free: Lead Free; RoHS Compliant: Yes; ComponentLink1URL: https://datasheet.ciiva.com/12561/pyu-rc0402-51-rohs-l-6-r-8721-12561757.pdf?src-supplier=Mouser; ComponentLink1Description: https://datasheet.ciiva.com/12561/pyu-rc0402-51-rohs-l-6-r-8721-12561757.pdf?src-supplier=Mouser; ComponentLink2URL: https://datasheet.ciiva.com/17073/pyu-rc0402-51-rohs-l-6-r-17073310.pdf?src-supplier=Future+Electronics; ComponentLink2Description: https://datasheet.ciiva.com/17073/pyu-rc0402-51-rohs-l-6-r-17073310.pdf?src-supplier=Future+Electronics; Supplier Part Number 1: 603-RC0402FR-0716K9L
U3 = REF3430TIDBVR: 3-V, low-drift, low-power, small-footprint series voltage reference 6-SOT-23 -40 to 125; Manufacturer: Texas Instruments; Supplier 1: Mouser; Manufacturer Part Number: REF3430TIDBVR; RoHS: No; Category: Voltage References; Stock 1: 13091; Pricing 1: 1=2,54, 10=1,66, 50=1,66, 100=1,46, 1000=1,25, 10000=1,03 (USD); Supplier Part Number 1: 595-REF3430TIDBVR
U4 = LM43603AQPWPTQ1: Automotive Qualified 3.5V to 36V, 3A Synchronous Step-Down Voltage Converter 16-HTSSOP -40 to 125; Manufacturer: Texas Instruments; Output Type: Adjustable; Output Configuration: Positive; Number of Outputs: 1; Min Output Voltage: 1V; Max Output Voltage: 28V; Switching Frequency: 2.2MHz; Synchronous Rectifier: Yes; Supplier 1: Mouser; Manufacturer Part Number: LM43603AQPWPTQ1; RoHS: Yes; Category: Voltage Regulators - Switching; Pricing 1: 1=6,95000, 10=6,24000, 50=5,90000, 100=5,11000, 1000=4,84000, 10000=4,84000 (USD); Mount: Surface Mount; Min Operating Temperature: -40°C; Max Operating Temperature: 125°C; Packaging: Tape and Reel; Min Input Voltage: 3.5V; Max Input Voltage: 36V; Output Current: 3A; RoHS Compliant: Yes; ComponentLink2URL: http://www.ti.com/lit/ds/symlink/lm43603-q1.pdf?src-supplier=Digi-Key; ComponentLink2Description: http://www.ti.com/lit/ds/symlink/lm43603-q1.pdf?src-supplier=Digi-Key; ComponentLink3URL: http://www.ti.com/general/docs/suppproductinfo.tsp?distId=10&amp;gotoUrl=http%3A%2F%2Fwww.ti.com%2Flit%2Fgpn%2Flm43603-q1&src-supplier=Digi-Key; ComponentLink3Description: http://www.ti.com/general/docs/suppproductinfo.tsp?distId=10&amp;gotoUrl=http%3A%2F%2Fwww.ti.com%2Flit%2Fgpn%2Flm43603-q1&src-supplier=Digi-Key; Supplier Part Number 1: 595-LM43603AQPWPTQ1
U5 U6 = TPS7B8601QDDARQ1: Automotive 500-mA, 40-V, ultra-low-IQ, low-dropout (LDO) linear regulator with power good 8-SO PowerPAD -40 to 150; Manufacturer: Texas Instruments; Supplier 1: Mouser; Manufacturer Part Number: TPS7B8601QDDARQ1; RoHS: Yes; Category: Integrated Circuits (ICs); Stock 1: 7087; Pricing 1: 1=2,23, 10=1,45, 50=1,45, 100=1,28, 1000=1,09, 10000=1,02 (USD); RoHS Compliant: Yes; Supplier Part Number 1: 595-TPS7B8601QDDARQ1
U7 = LM7705MME/NOPB: IC SW CAP/INV -230MV 20MA 8MSOP; Manufacturer: TI National Semiconductor; Supplier 1: Mouser; Manufacturer Part Number: LM7705MME/NOPB; RoHS: Yes; Category: Voltage Regulators - Switching; Stock 1: 2332; Pricing 1: 1=0,71, 10=0,448, 50=0,448, 100=0,389, 1000=0,377, 10000=0,377 (USD); Thickness: 970um; ComponentLink1URL: https://datasheet.ciiva.com/3215/lm7705-3215705.pdf?src-supplier=Avnet; ComponentLink1Description: https://datasheet.ciiva.com/3215/lm7705-3215705.pdf?src-supplier=Avnet; ComponentLink2URL: https://datasheet.ciiva.com/6579/lm7705-6579829.pdf?src-supplier=Digikey; ComponentLink2Description: https://datasheet.ciiva.com/6579/lm7705-6579829.pdf?src-supplier=Digikey; ComponentLink3URL: https://datasheet.ciiva.com/6579/lm7705-6579830.pdf?src-supplier=Digikey; ComponentLink3Description: https://datasheet.ciiva.com/6579/lm7705-6579830.pdf?src-supplier=Digikey; Supplier Part Number 1: 926-LM7705MME/NOPB